# Altium project ot-CO2.PrjPcb
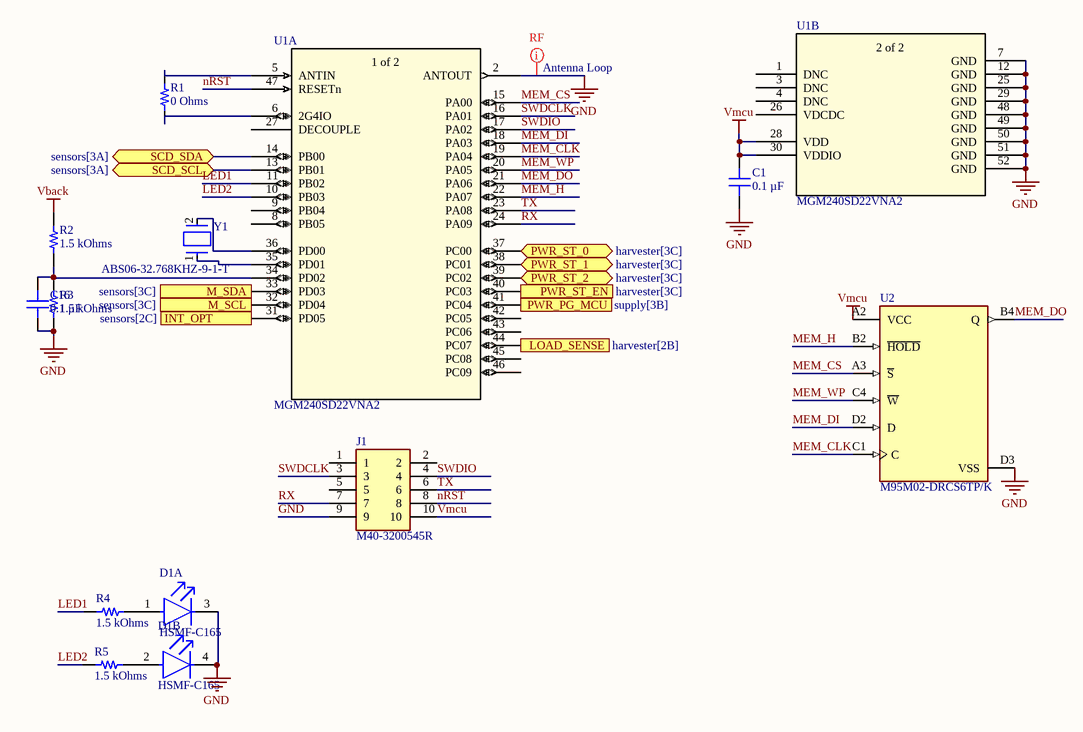
[diagram p0: mcu.SchDoc]
4 sheets, 48 parts. Net scope: flat (ports and power ports of the same name join across sheets).
Board file: pcb.PcbDoc
Sheets:
  mcu.SchDoc
  harvester.SchDoc
  sensors.SchDoc
  supply.SchDoc

## Sheet mcu.SchDoc
size A; SheetNumber: 1; SheetTotal: 4

### Parts
C1  0.1 µF  [CAP 0402_1005]
C16  0.1 µF  [CAP 0402_1005]
D1  HSMF-C165  [FP-HSMF-C165-MFG]  (parts A,B of 2)
J1  M40-3200545R  [HARWIN_M40-3200545R]
R1  0 Ohms  [RES 0201_0603]
R2  1.5 kOhms  [RES 0402_1005]
R3  1.5 kOhms  [RES 0402_1005]
R4  1.5 kOhms  [RES 0402_1005]
R5  1.5 kOhms  [RES 0402_1005]
U1  MGM240SD22VNA2  [xGM240S]  (parts A,B of 2)
U2  M95M02-DRCS6TP/K  [FP-WLCSP8-E1c_WLCSP8_noBS-MFG]
Y1  ABS06-32.768KHZ-9-1-T  [FP-ABS06-MFG]

### Ports
INT_OPT (in, see sensors[2C]), LOAD_SENSE (see harvester[2B]), M_SCL (see sensors[3C]), M_SDA (see sensors[3C]), PWR_PG_MCU (in, see supply[3B]), PWR_ST_0 (bidir, see harvester[3C]), PWR_ST_1 (bidir, see harvester[3C]), PWR_ST_2 (bidir, see harvester[3C]), PWR_ST_EN (out, see harvester[3C]), SCD_SCL (bidir, see sensors[3A]), SCD_SDA (bidir, see sensors[3A])

### Nets
GND: C1.1 C16.1 D1.3(GREEN_C) D1.4(RED_C) J1.9 R3.2 U1.2(ANTOUT) U1.7(GND) U1.12(GND) U1.25(GND) U1.29(GND) U1.48(GND) U1.49(GND) U1.50(GND) U1.51(GND) U1.52(GND) U2.D3(VSS)
Vback: R2.1
Vmcu: C1.2 J1.10 U1.28(VDD) U1.30(VDDIO) U2.A2(VCC)
LED1: R4.2 U1.11(PB02)
LED2: R5.2 U1.10(PB03)
MEM_CLK: U1.19(PA04) U2.C1(C)
MEM_CS: U1.15(PA00) U2.A3(~{S})
MEM_DI: U1.18(PA03) U2.D2(D)
MEM_DO: U1.21(PA06) U2.B4(Q)
MEM_H: U1.22(PA07) U2.B2(~{HOLD})
MEM_WP: U1.20(PA05) U2.C4(~{W})
nRST: J1.8 U1.47(RESETn)
RX: J1.7 U1.24(PA09)
SCL: U1.32(PD04) ; port M_SCL
SDA: U1.33(PD03) ; port M_SDA
SWDCLK: J1.3 U1.16(PA01)
SWDIO: J1.4 U1.17(PA02)
TX: J1.6 U1.23(PA08)
NetC16_2: C16.2 R2.2 R3.1 U1.34(PD02)
NetD1_1: D1.1(GREEN_A) R4.1
NetD1_2: D1.2(RED_A) R5.1
NetR1_1: R1.1 U1.6(2G4IO)
NetR1_2: R1.2 U1.5(ANTIN)
NetR11_2: U1.13(PB01) ; port SCD_SCL
NetR12_2: U1.14(PB00) ; port SCD_SDA
NetU1_31: U1.31(PD05) ; port INT_OPT
NetU1_35: U1.35(PD01) Y1.1
NetU1_36: U1.36(PD00) Y1.2
NetU1_37: U1.37(PC00) ; port PWR_ST_0
NetU1_38: U1.38(PC01) ; port PWR_ST_1
NetU1_39: U1.39(PC02) ; port PWR_ST_2
NetU1_40: U1.40(PC03) ; port PWR_ST_EN
NetU1_41: U1.41(PC04) ; port PWR_PG_MCU
NetU1_44: U1.44(PC07) ; port LOAD_SENSE

Not connected (* = marked no-connect by the designer): J1 1 2 5; U1 1(DNC) 3(DNC) 4(DNC) 8(PB05) 9(PB04) 26(VDCDC) 27(DECOUPLE) 42(PC05) 43(PC06) 45(PC08) 46(PC09)

### Layout directives
mark named RF: GND

### Notes on the sheet
- Antenna Loop
- (in symbol MGM240SD22VNA2, part A) 1 of 2
- (in symbol MGM240SD22VNA2, part B) 2 of 2

### Library data of the parts
C1 C16 = C0402C104K7PAC7867: CAP CER 0.1UF 4V X5R 0402; manufacturer: KEMET; Tolerance: ±10%; Part Number: C0402C104K7PAC7867; Value: 0.1 µF; Applications: Bypass, Decoupling; Capacitance: 0.1 µF; componentlink1description: Datasheet; componentlink1url: https://api.kemet.com/component-edge/download/datasheet/C0402C104K7PAC7867.pdf; componentlink2description: DigiKey Link; componentlink2url: https://www.digikey.com/en/products/detail/kemet/C0402C104K7PAC7867/7381987; Device Package: 0402 (1005 Metric); lastupdated: 1/9/2022 12:30:40 pm; Lifecycle Status: Active; Minimum Order: 1; Mounting Type: Surface Mount, MLCC; Operating Temperature: -55°C ~ 85°C; Package / Case: 0402 (1005 Metric); packaging: TapeAndReel; partid: 5603; Part Status: Active; price: 0.01; series: SMD Comm X5R; Size / Dimension: 0.039" L x 0.020" W (1.00mm x 0.50mm); Supplier 1: DigiKey; Supplier Part Number 1: 399-14871-1-ND; Temperature Coefficient: X5R; Thickness (Max): 0.022" (0.55mm); Voltage - Rated: 4V
D1 = CMP-2000-06424-2: LED GREEN/RED DIFFUSED 0603 SMD; Reverse Voltage: 5V; Dominant Wavelength: 621nm; Number of Elements: 2; Shape: Rectangular; Luminous Intensity: 10mcd; Forward Current: 20mA; Lens Color: White; Illumination Color: Green; Power Dissipation: 52mW; Wavelength: 572nm; Viewing Angle: 120°; Forward Voltage: 2.2V; Max Operating Temperature: 85°C; Lens Transparency: Diffused; Width: 0.8mm; Case/Package: 0603; Packaging: Tape and Reel; Case Code (Metric): 1608; Depth: 0.8mm; REACH SVHC: No SVHC; Number of LEDs: 2; Radiation Hardening: No; Lens Style: Rectangular; Color: Green; Case Code (Imperial): 0603; Min Operating Temperature: -40°C; Power Rating: 52mW; Number of Pins: 4; Number of Terminals: 4; Package Quantity: 1; Mount: Surface Mount; Height: 0.5mm; Length: 1.6mm; Lead Free: Lead Free; Test Current: 20mA
J1 = M40-3200545R: Connector Header Surface Mount 10 position 0.039 _1.00mm_; MF: Harwin Inc.; Package: None; MP: M40-3200545R; Value: *; Price: None; SnapEDA_Link: https://www.snapeda.com/parts/M40-3200545R/Harwin%20Inc./view-part/494409/?ref=snap; Availability: Unavailable
R1 = CRG0201F10R: RES SMD 10 OHM 1% 1/20W 0201; Manufacturer: TE Connectivity Passive Product; Power (Watts): 0.05W, 1/20W; Resistance: 10 Ohms; Temperature Coefficient: ±400ppm/°C; Part Number: CRG0201F10R; Value: 0 Ohms; ComponentLink1Description: Datasheet; ComponentLink1URL: https://www.te.com/commerce/DocumentDelivery/DDEController?Action=srchrtrv&DocNm=1773204&DocType=DS&DocLang=English; ComponentLink2Description: DigiKey Link; ComponentLink2URL: https://www.digikey.com/en/products/detail/te-connectivity-passive-product/CRG0201F10R/4489648; Composition: Thick Film; Device Package: 0201 (0603 Metric); Height - Seated (Max): 0.010" (0.26mm); LastUpdated: 5/4/2023 7:30:48 PM; Lifecycle Status: Active; Minimum Order: 1; Number of Terminations: 2; Operating Temperature: -55°C ~ 155°C; Package / Case: 0201 (0603 Metric); Packaging: TapeAndReel; PartId: 3; Part Status: Active; Price: 0.02; Series: CRG, Neohm; Size / Dimension: 0.024" L x 0.012" W (0.60mm x 0.30mm); Supplier 1: DigiKey; Supplier Part Number 1: A129573CT-ND; Supplier Device Package: 0201; Tolerance: ±1%
R2-R5 = ERA-2VRW1501X: RES 1.5K OHM 0.05% 1/10W 0402; Manufacturer: Panasonic Electronic Components; Power (Watts): 0.1W, 1/10W; Temperature Coefficient: ±10ppm/°C; Part Number: ERA-2VRW1501X; Value: 1.5 kOhms; ComponentLink1Description: Datasheet; ComponentLink1URL: https://api.pim.na.industrial.panasonic.com/file_stream/main/fileversion/9152; ComponentLink2Description: DigiKey Link; ComponentLink2URL: https://www.digikey.com/en/products/detail/panasonic-electronic-components/ERA-2VRW1501X/12086957; Composition: Thin Film; Device Package: 0402 (1005 Metric); Features: Anti-Sulfur, Automotive AEC-Q200; Height - Seated (Max): 0.016" (0.40mm); LastUpdated: 11/9/2022 9:53:08 am; Lifecycle Status: Active; Minimum Order: 1; Number of Terminations: 2; Operating Temperature: -55°C ~ 155°C; Package / Case: 0402 (1005 Metric); Packaging: TapeAndReel; PartId: 67400; Part Status: Active; Price: 0.24; Ratings: AEC-Q200; Resistance: 1.5 kOhms; Series: ERA-2V; Size / Dimension: 0.039" L x 0.020" W (1.00mm x 0.50mm); Supplier 1: DigiKey; Supplier Part Number 1: 10-ERA-2VRW1501XCT-ND; Supplier Device Package: 0402; Tolerance: ±0.05%
U1 = MGM240SD22VNA2: No Description Available; Mfr_Name: Silicon Labs; RefDes: RefDes; Type: Type
U2 = CMP-12142-000007-1: IC EEPROM 2M SPI 5MHZ 8WLCSP; Manufacturer: STMicroelectronics; Standoff Height: 0.19mm; Min Supply Voltage: 1.8V; Access Time: 80ns; Nominal Supply Current: 3mA; Memory Size: 2Mbits; Max Supply Voltage: 5.5V; Ambient Temperature Range Low: -40°C; Interface: SPI; Mouser Description: EEPROM 2 Mbit serial I2C 30pF 1.8 to 5.5V; Temperature Range High: +85°C; Device Class L2: Memory; Automotive: No; ComponentLink2URL: https://www.st.com/resource/en/datasheet/m95m02-dr.pdf; Digikey Description: IC EEPROM 2M SPI 5MHZ 8WLCSP; RoHS: TRUE; Height: 0.58mm; Memory Type: EEPROM; Octopart: https://octopart.com/m95m02-drcs6tp%2Fk-stmicroelectronics-30038214; Frequency: 5MHz; Category: IC; Ambient Temperature Range High: +85°C; Lead Free: Yes; Device Class L1: Integrated Circuits (ICs); Device Class L3: EEPROM; Temperature: -40°C to +85°C; Manufacturer Part Number: M95M02-DRCS6TP/K; ComponentLink2Description: Datasheet; Package: WLCSP8-E1c_WLCSP8_noBSC; Temperature Range Low: -40°C
Y1 = CMP-27762-003430-2: Crystal 32.768kHz ±10ppm (Tol) 9pF FUND 90kΩ 2-Pin Mini-CSMD T/R; Series Resistance: 90kR; Series: ABS06; Case/Package: CSMD; Package Quantity: 3000; Load Capacitance: 9pF; Number of Pins: 2; Tolerance: 10ppm; RoHS Compliant: Yes; Depth: 1.2mm; Termination: SMD/SMT; Min Operating Temperature: -40°C; Length: 2mm; Packaging: Tape and Reel; Max Operating Temperature: 85°C; Frequency Tolerance: 10ppm; Width: 1.2mm; ESR (Equivalent Series Resistance): 90kR; Radiation Hardening: No; Frequency: 32.768kHz; REACH SVHC: No SVHC; Mount: Surface Mount; Height: 0.6mm

## Sheet harvester.SchDoc
size A; SheetNumber: 2; SheetTotal: 4
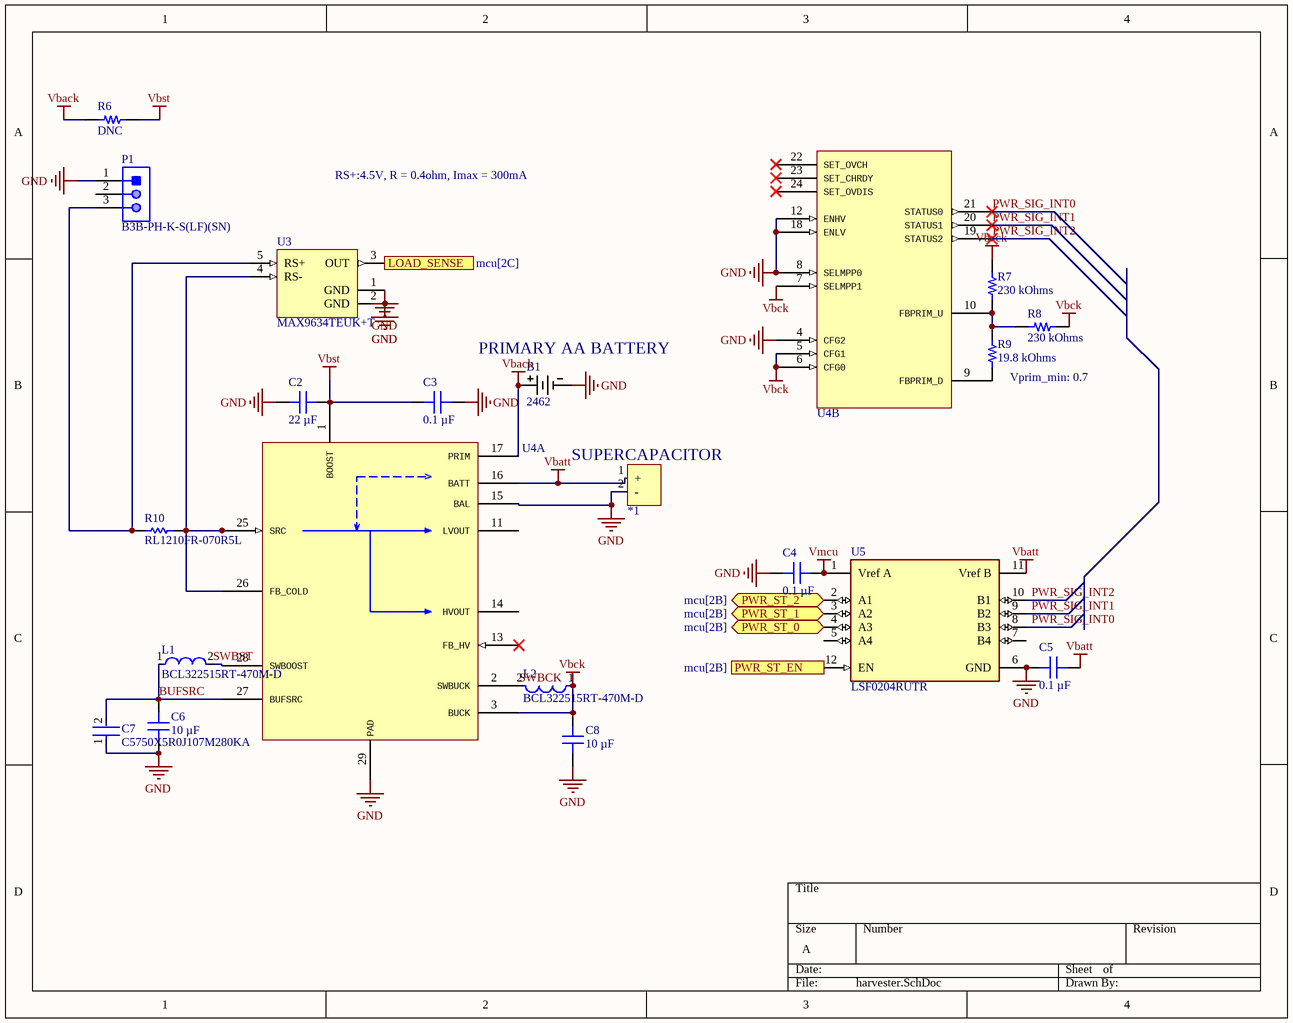
[diagram p1: harvester.SchDoc]

### Parts
*1  FC0H474ZFTBR32-SS  [FC0H474ZFTBR32-SS-Footprint-1]  (value not drawn)
B1  2462  [2462_KEY]
C2  22 µF  [CAP 0603_1608]
C3  0.1 µF  [CAP 0402_1005]
C4  0.1 µF  [CAP 0402_1005]
C5  0.1 µF  [CAP 0402_1005]
C6  10 µF  [CAP 0603_1608]
C7  C5750X5R0J107M280KA  [FP-C5750-280-0_4-IPC_A]
C8  10 µF  [CAP 0603_1608]
L1  BCL322515RT-470M-D  [FP-BCL322515-IPC_C]
L2  BCL322515RT-470M-D  [FP-BCL322515-IPC_C]
P1  B3B-PH-K-S(LF)(SN)  [JST-B3B-PH-K-S-3_V]
R6  DNC  [RES 0402_1005]
R7  230 kOhms  [RES 0402_1005]
R8  230 kOhms  [RES 0402_1005]
R9  19.8 kOhms  [RES 0402_1005]
R10  RL1210FR-070R5L  [RESC3126X65X50NL10T20]
U3  MAX9634TEUK+T  [MAXM-U5+2_L]
U4  AEM10941 - Symbol QFN28  [QFN28 5x5mm Pitch=0.5mm ThPad=3.15x3.15mm]  (value not drawn)  (parts A,B of 2)
U5  LSF0204RUTR  [FP-RUT0012A-MFG]

### Ports
LOAD_SENSE (see mcu[2C]), PWR_ST_0 (bidir, see mcu[2B]), PWR_ST_1 (bidir, see mcu[2B]), PWR_ST_2 (bidir, see mcu[2B]), PWR_ST_EN (in, see mcu[2B])

### Nets
GND: *1.2(-) B1.1 C2.1 C3.1 C4.1 C5.2 C6.1 C7.1 C8.2 P1.1 U3.1(GND) U3.2(GND) U4.4(CFG2) U4.8(SELMPP0) U4.12(ENHV) U4.15(BAL) U4.18(ENLV) U4.29(PAD) U5.6(GND)
Vback: B1.2 R6.2 R7.2 U4.17(PRIM)
Vbatt: *1.1(+) C5.1 U4.16(BATT) U5.11(Vref_B)
Vbck: C8.1 L2.1 R8.2 U4.3(BUCK) U4.5(CFG1) U4.6(CFG0) U4.7(SELMPP1)
Vbst: C2.2 C3.2 R6.1 U4.1(BOOST)
Vmcu: C4.2 U5.1(Vref_A)
BUFSRC: C6.2 C7.2 L1.1 U4.27(BUFSRC)
PWR_SIG_INT0: U4.21(STATUS0) U5.8(B3)
PWR_SIG_INT1: U4.20(STATUS1) U5.9(B2)
PWR_SIG_INT2: U4.19(STATUS2) U5.10(B1)
SWBCK: L2.2 U4.2(SWBUCK)
SWBST: L1.2 U4.28(SWBOOST)
NetP1_3: P1.3 R10.1 U3.5(RS+)
NetR7_1: R7.1 R8.1 R9.1 U4.10(FBPRIM_U)
NetR9_2: R9.2 U4.9(FBPRIM_D)
NetR10_2: R10.2 U3.4(RS-) U4.25(SRC) U4.26(FB_COLD)
NetU1_37: U5.4(A3) ; port PWR_ST_0
NetU1_38: U5.3(A2) ; port PWR_ST_1
NetU1_39: U5.2(A1) ; port PWR_ST_2
NetU1_40: U5.12(EN) ; port PWR_ST_EN
NetU1_44: U3.3(OUT) ; port LOAD_SENSE

Not connected (* = marked no-connect by the designer): P1 2; U4 11(LVOUT) 13(FB_HV)* 14(HVOUT) 22(SET_OVCH)* 23(SET_CHRDY)* 24(SET_OVDIS)*; U5 5(A4) 7(B4)

### Notes on the sheet
- RS+:4.5V, R = 0.4ohm, Imax = 300mA
- (near B1) PRIMARY AA BATTERY
- (near R9) Vprim_min: 0.7
- (near *1) SUPERCAPACITOR

### Library data of the parts
*1 = CMP-001-00083-1: Cap Supercap 0.47F 5.5V -20% to 80% (16 X 9.5mm) SMD Cylindrical 13 Ohm 70C T/R
B1 = 2462: No Description Available; Mfr_Name: Keystone Electronics
C2 = GRM188R60J106ME47D: CAP CER 22UF 6.3V X5R 0603; manufacturer: Murata Electronics; Tolerance: ±20%; Part Number: GRM188R60J106ME47D; Value: 22 µF; Applications: General Purpose; Capacitance: 22 µF; componentlink1description: Datasheet; componentlink1url: https://www.murata.com/~/media/webrenewal/support/library/catalog/products/capacitor/mlcc/c02e.ashx?la=en-us; componentlink2description: DigiKey Link; componentlink2url: https://www.digikey.com/en/products/detail/murata-electronics/GRM188R60J106ME47D/965910; Device Package: 0603 (1608 Metric); lastupdated: 11/9/2022 9:40:24 am; Lifecycle Status: Active; Minimum Order: 1; Mounting Type: Surface Mount, MLCC; Operating Temperature: -55°C ~ 85°C; Package / Case: 0603 (1608 Metric); packaging: TapeAndReel; partid: 2351; Part Status: Active; price: 0.02; series: GRM; Size / Dimension: 0.063" L x 0.031" W (1.60mm x 0.80mm); Supplier 1: DigiKey; Supplier Part Number 1: 490-3896-1-ND; Temperature Coefficient: X5R; Thickness (Max): 0.035" (0.90mm); Voltage - Rated: 6.3V
C3-C5 = C0402C104K7PAC7867: as C1 on sheet mcu; Part Number: C0402C104K7PAC7867; Value: 0.1 µF; Applications: Bypass, Decoupling; Capacitance: 0.1 µF; componentlink1description: Datasheet; componentlink1url: https://api.kemet.com/component-edge/download/datasheet/C0402C104K7PAC7867.pdf; componentlink2description: DigiKey Link; componentlink2url: https://www.digikey.com/en/products/detail/kemet/C0402C104K7PAC7867/7381987; Device Package: 0402 (1005 Metric); lastupdated: 1/9/2022 12:30:40 pm; Lifecycle Status: Active; Minimum Order: 1; Mounting Type: Surface Mount, MLCC; Operating Temperature: -55°C ~ 85°C; Package / Case: 0402 (1005 Metric); packaging: TapeAndReel; partid: 5603; Part Status: Active; price: 0.01; series: SMD Comm X5R; Size / Dimension: 0.039" L x 0.020" W (1.00mm x 0.50mm); Supplier 1: DigiKey; Supplier Part Number 1: 399-14871-1-ND; Temperature Coefficient: X5R; Thickness (Max): 0.022" (0.55mm); Voltage - Rated: 4V
C6 C8 = GRM188R60J106ME47D: CAP CER 10UF 6.3V X5R 0603; manufacturer: Murata Electronics; Tolerance: ±20%; Part Number: GRM188R60J106ME47D; Value: 10 µF; Applications: General Purpose; Capacitance: 10 µF; componentlink1description: Datasheet; componentlink1url: https://www.murata.com/~/media/webrenewal/support/library/catalog/products/capacitor/mlcc/c02e.ashx?la=en-us; componentlink2description: DigiKey Link; componentlink2url: https://www.digikey.com/en/products/detail/murata-electronics/GRM188R60J106ME47D/965910; Device Package: 0603 (1608 Metric); lastupdated: 11/9/2022 9:40:24 am; Lifecycle Status: Active; Minimum Order: 1; Mounting Type: Surface Mount, MLCC; Operating Temperature: -55°C ~ 85°C; Package / Case: 0603 (1608 Metric); packaging: TapeAndReel; partid: 2351; Part Status: Active; price: 0.02; series: GRM; Size / Dimension: 0.063" L x 0.031" W (1.60mm x 0.80mm); Supplier 1: DigiKey; Supplier Part Number 1: 490-3896-1-ND; Temperature Coefficient: X5R; Thickness (Max): 0.035" (0.90mm); Voltage - Rated: 6.3V
C7 = CMP-08246-006651-1: Multilayer Ceramic Capacitors 100uF ±20% 6.3V X5R SMD 2220; Min Operating Temperature: -55°C; Height: 2.8mm; Case/Package: 2220; Resistor Type: Ceramic; Construction: Flat; Max Operating Temperature: 85°C; REACH SVHC: No SVHC; Length: 5.7mm; Width: 0.197inch; Thickness: 0.122inch; Case Code (Imperial): 2220; Number of Pins: 2; Weight: 0.016932oz; Dielectric Material: Ceramic; Dielectric: X5R; Depth: 5mm; Capacitance: 100uF; Voltage Rating (DC): 6.3V; Package Quantity: 1; Packaging: Tape and Reel; Case Code (Metric): 5750; Lead Free: Lead Free; RoHS Compliant: Yes; Series: C; Termination: SMD/SMT; Tolerance: 20%; Mount: Surface Mount; Voltage Rating: 6.3V
L1 L2 = CMP-08253-000181-1: FIXED IND 47UH 670MA 1.4 OHM SMD
P1 = CMP-2000-05164-1: Male Header, Pitch 2 mm, 1 x 3 Position, Height 6 mm, Tail Length 3.4 mm, -25 to 85 degC, RoHS, Bulk; Manufacturer: JST; Style/Orientation: StraightHeader/Plug; Pitch: 2mm; No of Positions: 3; Termination: Crimp; Manufacturer URL: http://www.jst.com/home2.html; Datasheet Version: Oct-06; Type: ShroudedHeader; Datasheet URL: https://datasheet.ciiva.com/11746/0900766b80826550-11746939.pdf
R6 = ERA-2VRW1501X: RES 1.5K OHM 0.05% 1/10W 0402; Manufacturer: Panasonic Electronic Components; Power (Watts): 0.1W, 1/10W; Resistance: 1.5 kOhms; Temperature Coefficient: ±10ppm/°C; Part Number: ERA-2VRW1501X; Value: DNC; ComponentLink1Description: Datasheet; ComponentLink1URL: https://api.pim.na.industrial.panasonic.com/file_stream/main/fileversion/9152; ComponentLink2Description: DigiKey Link; ComponentLink2URL: https://www.digikey.com/en/products/detail/panasonic-electronic-components/ERA-2VRW1501X/12086957; Composition: Thin Film; Device Package: 0402 (1005 Metric); Features: Anti-Sulfur, Automotive AEC-Q200; Height - Seated (Max): 0.016" (0.40mm); LastUpdated: 11/9/2022 9:53:08 am; Lifecycle Status: Active; Minimum Order: 1; Number of Terminations: 2; Operating Temperature: -55°C ~ 155°C; Package / Case: 0402 (1005 Metric); Packaging: TapeAndReel; PartId: 67400; Part Status: Active; Price: 0.24; Ratings: AEC-Q200; Series: ERA-2V; Size / Dimension: 0.039" L x 0.020" W (1.00mm x 0.50mm); Supplier 1: DigiKey; Supplier Part Number 1: 10-ERA-2VRW1501XCT-ND; Supplier Device Package: 0402; Tolerance: ±0.05%
R7-R9 = RP73PF1E10KBTD: RES 10K OHM 0.1% 1/10W 0402; Manufacturer: TE Connectivity Passive Product; Power (Watts): 0.1W, 1/10W; Resistance: 10 kOhms; Temperature Coefficient: ±25ppm/°C; Part Number: RP73PF1E10KBTD; ComponentLink1Description: Datasheet; ComponentLink1URL: https://www.te.com/commerce/DocumentDelivery/DDEController?Action=srchrtrv&DocNm=1773272&DocType=DS&DocLang=English; ComponentLink2Description: DigiKey Link; ComponentLink2URL: https://www.digikey.com/en/products/detail/te-connectivity-passive-product/RP73PF1E10KBTD/8260957; Composition: Thin Film; Device Package: 0402 (1005 Metric); Height - Seated (Max): 0.014" (0.35mm); LastUpdated: 1/9/2022 12:46:57 pm; Lifecycle Status: Active; Minimum Order: 1; Number of Terminations: 2; Operating Temperature: -55°C ~ 155°C; Package / Case: 0402 (1005 Metric); Packaging: TapeAndReel; PartId: 2434; Part Status: Active; Price: 0.09; Series: RP73, Holsworthy; Size / Dimension: 0.039" L x 0.020" W (1.00mm x 0.50mm); Supplier 1: DigiKey; Supplier Part Number 1: A127415CT-ND; Supplier Device Package: 0402; Tolerance: ±0.1%
  R7 R8: Value: 230 kOhms
  R9: Value: 19.8 kOhms
R10 = CMP-2005-02088-1: Manufacturer: Yageo; Part Number: RL1210FR-070R5L
U3 = CMP-0252-00051-2: 1 uA, 4-Bump, Precision Current-Sense Amplifier, 25 V / V Gain, -40 to 85 degC, 5-Pin SOT23 (U5+2), Pb-Free, Tape and Reel; Gain: 25 V/V, 50 V/V ,100 V/V ,200 V/V; Bi-Dir. Curr. Sense: No; Code_JEDEC: MO178; PackageReference: U5+2; PackageDescription: 5-Pin Small-Outline Transistor Package, Body 1.625 x 2.9 mm, Pitch 0.95 mm; Mounting Technology: Surface Mount; ComponentLink3URL: http://pdfserv.maximintegrated.com/package_dwgs/21-0057.PDF; ComponentLink1URL: http://www.maximintegrated.com/; ComponentLink2Description: Datasheet; ComponentLink1Description: Manufacturer URL; PartNumber: MAX9634TEUK+T; PackageVersion: Rev. G, 04/2011; ComponentLink3Description: Package Specification; ComponentLink2URL: http://datasheets.maximintegrated.com/en/ds/MAX9634.pdf; DatasheetVersion: Rev. 2
U5 = CMP-04899-000054-1: IC TRNSLTR BIDIRECTIONAL 12UQFN; Number of Bits: 4; Quiescent Current: 3.5uA; Min Supply Voltage: 1V; Propagation Delay: 1.5ns; Output Type: TTL; Number of Circuits: 1; Max Supply Voltage: 5.5V; Logic Function: Translator; RoHS Compliant: Yes; Package Quantity: 3000; Channel Type: Bidirectional; Mount: Surface Mount; Packaging: Tape and Reel; Operating Supply Current: 3.5uA; Max Operating Temperature: 125°C; Min Operating Temperature: -40°C; Lead Free: Lead Free; Number of Pins: 12

## Sheet sensors.SchDoc
size A; SheetNumber: 3; SheetTotal: 4
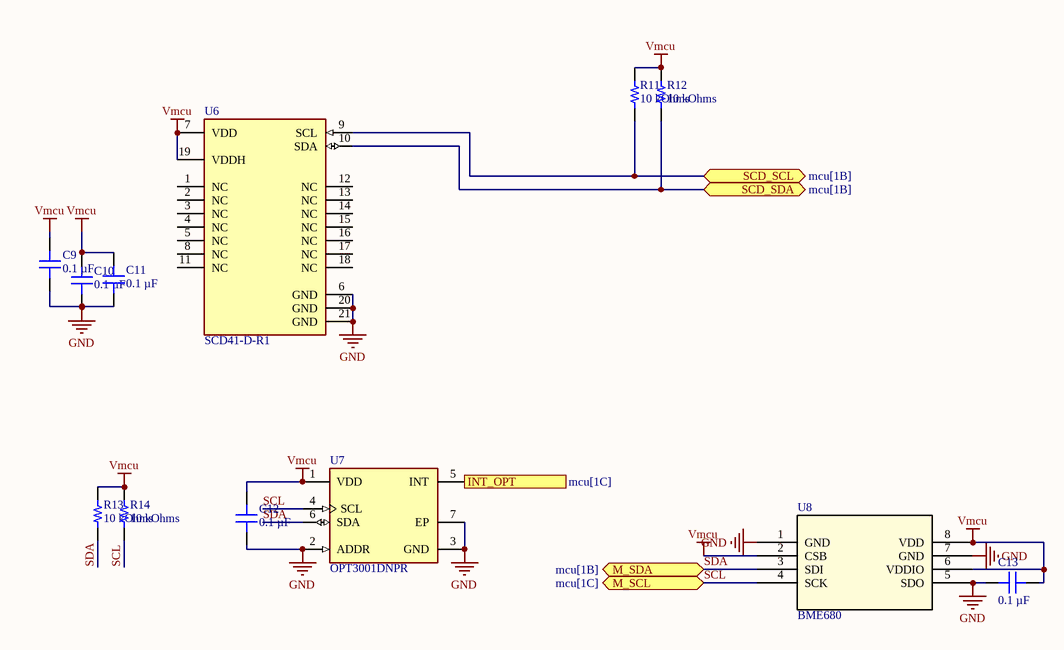
[diagram p2: sensors.SchDoc]

### Parts
C9  0.1 µF  [CAP 0402_1005]
C10  0.1 µF  [CAP 0402_1005]
C11  0.1 µF  [CAP 0402_1005]
C12  0.1 µF  [CAP 0402_1005]
C13  0.1 µF  [CAP 0402_1005]
R11  10 kOhms  [RES 0402_1005]
R12  10 kOhms  [RES 0402_1005]
R13  10 kOhms  [RES 0402_1005]
R14  10 kOhms  [RES 0402_1005]
U6  SCD41-D-R1  [FP-SCD41-D-R1-MFG]
U7  OPT3001DNPR  [FP-DNP0006A-MFG]
U8  BME680  [LGA8_BME680_BOS]

### Ports
INT_OPT (out, see mcu[1C]), M_SCL (bidir, see mcu[1C]), M_SDA (bidir, see mcu[1B]), SCD_SCL (bidir, see mcu[1B]), SCD_SDA (bidir, see mcu[1B])

### Nets
GND: C9.1 C10.1 C11.1 C12.1 C13.2 U6.6(GND) U6.20(GND) U6.21(GND) U7.2(ADDR) U7.3(GND) U7.7(EP) U8.1(GND) U8.5(SDO) U8.7(GND)
Vmcu: C9.2 C10.2 C11.2 C12.2 C13.1 R11.1 R12.1 R13.1 R14.1 U6.7(VDD) U6.19(VDDH) U7.1(VDD) U8.2(CSB) U8.6(VDDIO) U8.8(VDD)
SCL: R14.2 U7.4(SCL) U8.4(SCK) ; port M_SCL
SDA: R13.2 U7.6(SDA) U8.3(SDI) ; port M_SDA
NetR11_2: R11.2 U6.9(SCL) ; port SCD_SCL
NetR12_2: R12.2 U6.10(SDA) ; port SCD_SDA
NetU1_31: U7.5(INT) ; port INT_OPT

Not connected (* = marked no-connect by the designer): U6 1(NC) 2(NC) 3(NC) 4(NC) 5(NC) 8(NC) 11(NC) 12(NC) 13(NC) 14(NC) 15(NC) 16(NC) 17(NC) 18(NC)

### Library data of the parts
C9-C13 = C0402C104K7PAC7867: as C1 on sheet mcu; Part Number: C0402C104K7PAC7867; Value: 0.1 µF; Applications: Bypass, Decoupling; Capacitance: 0.1 µF; componentlink1description: Datasheet; componentlink1url: https://api.kemet.com/component-edge/download/datasheet/C0402C104K7PAC7867.pdf; componentlink2description: DigiKey Link; componentlink2url: https://www.digikey.com/en/products/detail/kemet/C0402C104K7PAC7867/7381987; Device Package: 0402 (1005 Metric); lastupdated: 1/9/2022 12:30:40 pm; Lifecycle Status: Active; Minimum Order: 1; Mounting Type: Surface Mount, MLCC; Operating Temperature: -55°C ~ 85°C; Package / Case: 0402 (1005 Metric); packaging: TapeAndReel; partid: 5603; Part Status: Active; price: 0.01; series: SMD Comm X5R; Size / Dimension: 0.039" L x 0.020" W (1.00mm x 0.50mm); Supplier 1: DigiKey; Supplier Part Number 1: 399-14871-1-ND; Temperature Coefficient: X5R; Thickness (Max): 0.022" (0.55mm); Voltage - Rated: 4V
R11-R14 = RP73PF1E10KBTD: RES 10K OHM 0.1% 1/10W 0402; Manufacturer: TE Connectivity Passive Product; Power (Watts): 0.1W, 1/10W; Temperature Coefficient: ±25ppm/°C; Part Number: RP73PF1E10KBTD; Value: 10 kOhms; ComponentLink1Description: Datasheet; ComponentLink1URL: https://www.te.com/commerce/DocumentDelivery/DDEController?Action=srchrtrv&DocNm=1773272&DocType=DS&DocLang=English; ComponentLink2Description: DigiKey Link; ComponentLink2URL: https://www.digikey.com/en/products/detail/te-connectivity-passive-product/RP73PF1E10KBTD/8260957; Composition: Thin Film; Device Package: 0402 (1005 Metric); Height - Seated (Max): 0.014" (0.35mm); LastUpdated: 1/9/2022 12:46:57 pm; Lifecycle Status: Active; Minimum Order: 1; Number of Terminations: 2; Operating Temperature: -55°C ~ 155°C; Package / Case: 0402 (1005 Metric); Packaging: TapeAndReel; PartId: 2434; Part Status: Active; Price: 0.09; Resistance: 10 kOhms; Series: RP73, Holsworthy; Size / Dimension: 0.039" L x 0.020" W (1.00mm x 0.50mm); Supplier 1: DigiKey; Supplier Part Number 1: A127415CT-ND; Supplier Device Package: 0402; Tolerance: ±0.1%
U6 = CMP-144026-000007-1: CO2 SENSOR 40 PPM I2C SMD
U7 = CMP-04942-000002-1: SENSOR OPT 550NM AMBIENT 6USON; Manufacturer: Texas Instruments; Max Junction Temp: +150°C; Operating Supply Current: 0.3-1.8uA; Sensor Output: I2C,SMBus; Max Supply Voltage: 3.6V; Min Supply Voltage: 1.6V; Standoff Height: 0mm; Package: DNP0006A; Device Class L2: Optical Sensors; Temperature Range Low: -40°C; Digikey Description: SENSOR OPT 550NM AMBIENT 6USON; Automotive: No; Category: IC; Manufacturer Part Number: OPT3001DNPR; RoHS: TRUE; ComponentLink2URL: http://www.ti.com/lit/ds/symlink/opt3001.pdf; Lead Free: Yes; Octopart: https://octopart.com/opt3001dnpr-texas+instruments-47324050; Device Class L3: unset; ComponentLink2Description: Datasheet; Device Class L1: Sensors; Temperature Range High: +85°C; Temperature: -40°C to +85°C; Height: 0.65mm; Ipc Land Pattern Name: DFN200X200X60-6
U8 = BME680: No Description Available; Mfr_Name: Bosch Sensortec; RefDes: RefDes; Type: Type

## Sheet supply.SchDoc
size A; SheetNumber: 4; SheetTotal: 4
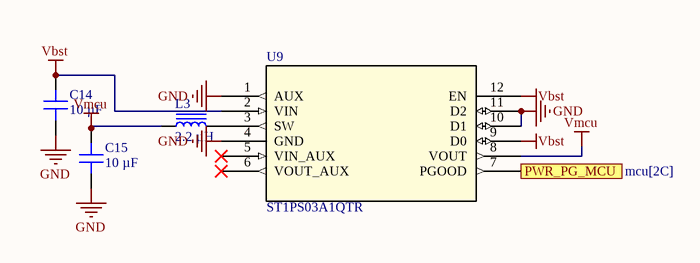
[diagram p3: supply.SchDoc]

### Parts
C14  10 µF  [CAP 0402_1005]
C15  10 µF  [CAP 0402_1005]
L3  2.2 µH  [TDK VLS201612CX]
U9  ST1PS03A1QTR  [TQFN12_2X1P7_STM]

### Ports
PWR_PG_MCU (out, see mcu[2C])

### Nets
GND: C14.2 C15.2 U9.1(AUX) U9.4(GND) U9.10(D1) U9.11(D2)
Vbst: C14.1 U9.2(VIN) U9.9(D0) U9.12(EN)
Vmcu: C15.1 L3.1 U9.8(VOUT)
NetL3_2: L3.2 U9.3(SW)
NetU1_41: U9.7(PGOOD) ; port PWR_PG_MCU

Not connected (* = marked no-connect by the designer): U9 5(VIN_AUX)* 6(VOUT_AUX)*

### Library data of the parts
C14 C15 = C0402C104K7PAC7867: CAP CER 0.1UF 4V X5R 0402; manufacturer: KEMET; Capacitance: 0.1 µF; Tolerance: ±10%; Part Number: C0402C104K7PAC7867; Value: 10 µF; Applications: Bypass, Decoupling; componentlink1description: Datasheet; componentlink1url: https://api.kemet.com/component-edge/download/datasheet/C0402C104K7PAC7867.pdf; componentlink2description: DigiKey Link; componentlink2url: https://www.digikey.com/en/products/detail/kemet/C0402C104K7PAC7867/7381987; Device Package: 0402 (1005 Metric); lastupdated: 1/9/2022 12:30:40 pm; Lifecycle Status: Active; Minimum Order: 1; Mounting Type: Surface Mount, MLCC; Operating Temperature: -55°C ~ 85°C; Package / Case: 0402 (1005 Metric); packaging: TapeAndReel; partid: 5603; Part Status: Active; price: 0.01; series: SMD Comm X5R; Size / Dimension: 0.039" L x 0.020" W (1.00mm x 0.50mm); Supplier 1: DigiKey; Supplier Part Number 1: 399-14871-1-ND; Temperature Coefficient: X5R; Thickness (Max): 0.022" (0.55mm); Voltage - Rated: 4V
L3 = VLS201612CX-6R8M-1: FIXED IND 6.8UH 930MA 368MOHM SM; Manufacturer: TDK Corporation; Current - Saturation: 730mA; DC Resistance (DCR): 368mOhm Max; Inductance: 6.8 µH; Inductance Frequency - Test: 1 MHz; Material - Core: Ferrite; Shielding: Shielded; Tolerance: ±20%; Type: Drum Core, Wirewound; Part Number: VLS201612CX-6R8M-1; ComponentLink1Description: Datasheet; ComponentLink1URL: https://product.tdk.com/info/en/catalog/datasheets/inductor_commercial_power_vls201612cx-1_en.pdf?ref_disty=digikey; ComponentLink2Description: DigiKey Link; ComponentLink2URL: https://www.digikey.com/en/products/detail/tdk-corporation/VLS201612CX-6R8M-1/5169771; Current Rating (Amps): 930 mA; Device Package: Nonstandard; Height - Seated (Max): 0.047" (1.20mm); LastUpdated: 11/9/2022 10:31:03 am; Lifecycle Status: Active; Minimum Order: 1; Mounting Type: Surface Mount; Operating Temperature: -40°C ~ 105°C; Package / Case: Nonstandard; Packaging: TapeAndReel; PartId: 207; Part Status: Active; Price: 0.13; Series: VLS-CX-1; Size / Dimension: 0.079" L x 0.063" W (2.00mm x 1.60mm); Supplier 1: DigiKey; Supplier Part Number 1: 445-172966-1-ND; Supplier Device Package: 2016; Value: 2.2 µH
U9 = ST1PS03A1QTR: No Description Available; Mfr_Name: STMicroelectronics; RefDes: RefDes; Type: Type

## Nets that join several sheets
GND: mcu (17 pins), harvester (19 pins), sensors (14 pins), supply (6 pins)
Vback: mcu (R2.1), harvester (B1.2 R6.2 R7.2 U4.17)
Vbst: harvester (C2.2 C3.2 R6.1 U4.1), supply (C14.1 U9.2 U9.9 U9.12)
Vmcu: mcu (5 pins), harvester (C4.2 U5.1), sensors (15 pins), supply (C15.1 L3.1 U9.8)
NetR11_2: mcu (U1.13), sensors (R11.2 U6.9)
NetR12_2: mcu (U1.14), sensors (R12.2 U6.10)
NetU1_31: mcu (U1.31), sensors (U7.5)
NetU1_37: mcu (U1.37), harvester (U5.4)
NetU1_38: mcu (U1.38), harvester (U5.3)
NetU1_39: mcu (U1.39), harvester (U5.2)
NetU1_40: mcu (U1.40), harvester (U5.12)
NetU1_41: mcu (U1.41), supply (U9.7)
NetU1_44: mcu (U1.44), harvester (U3.3)
SCL: mcu (U1.32), sensors (R14.2 U7.4 U8.4)
SDA: mcu (U1.33), sensors (R13.2 U7.6 U8.3)